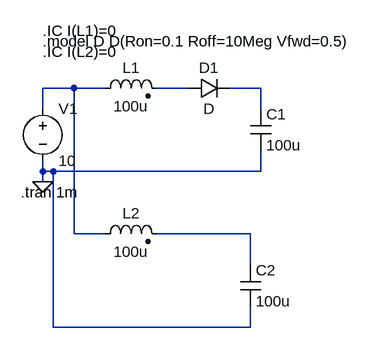
[diagram p0: schematic LC-circuit.asc]
LC-circuit.asc, the LTspice schematic file:
Version 4
SHEET 1 880 680
WIRE 128 48 80 48
WIRE 176 48 128 48
WIRE 304 48 256 48
WIRE 416 48 368 48
WIRE 80 80 80 48
WIRE 416 80 416 48
WIRE 80 176 80 160
WIRE 96 176 80 176
WIRE 416 176 416 144
WIRE 416 176 96 176
WIRE 80 192 80 176
WIRE 128 272 128 48
WIRE 176 272 128 272
WIRE 400 272 256 272
WIRE 400 320 400 272
WIRE 96 416 96 176
WIRE 400 416 400 384
WIRE 400 416 96 416
FLAG 80 192 0
SYMBOL voltage 80 64 R0
WINDOW 123 0 0 Left 0
WINDOW 39 0 0 Left 0
SYMATTR InstName V1
SYMATTR Value 10
SYMBOL ind2 160 64 R270
WINDOW 0 32 56 VTop 2
WINDOW 3 4 56 VBottom 2
SYMATTR InstName L1
SYMATTR Value 100u
SYMBOL cap 400 80 R0
SYMATTR InstName C1
SYMATTR Value 100u
SYMATTR Value2 IC=0
SYMBOL diode 304 64 R270
WINDOW 0 32 32 VTop 2
WINDOW 3 0 32 VBottom 2
SYMATTR InstName D1
SYMBOL cap 384 320 R0
SYMATTR InstName C2
SYMATTR Value 100u
SYMATTR Value2 IC=0
SYMBOL ind2 160 288 R270
WINDOW 0 32 56 VTop 2
WINDOW 3 4 56 VBottom 2
SYMATTR InstName L2
SYMATTR Value 100u
TEXT 80 -40 Left 2 !.IC I(L1)=0
TEXT 46 208 Left 2 !.tran 1m
TEXT 80 -24 Left 2 !.model D D(Ron=0.1 Roff=10Meg Vfwd=0.5)
TEXT 80 -8 Left 2 !.IC I(L2)=0

The netlist it stands for:
* LC-circuit.asc
V1 N001 0 10
L1 N001 N002 100u
C1 N003 0 100u IC=0
D1 N002 N003 D
C2 N004 0 100u IC=0
L2 N001 N004 100u
.model D D
.lib standard.dio
.IC I(L1)=0
.tran 1m
.model D D(Ron=0.1 Roff=10Meg Vfwd=0.5)
.IC I(L2)=0
.backanno
.end